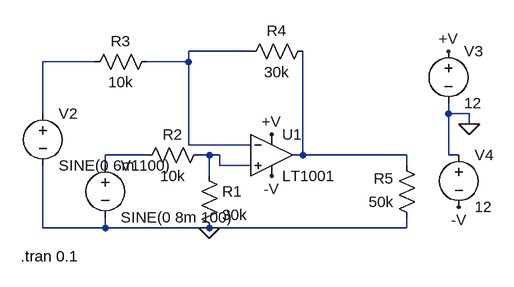
[diagram p0: schematic Draft21.asc]
Draft21.asc, the LTspice schematic file:
Version 4
SHEET 1 880 680
WIRE 192 16 96 16
WIRE -48 32 -128 32
WIRE 96 32 96 16
WIRE 96 32 32 32
WIRE -128 112 -128 32
WIRE 496 112 496 96
WIRE 528 112 496 112
WIRE 528 128 528 112
WIRE 96 160 96 32
WIRE 192 160 96 160
WIRE 32 176 -32 176
WIRE 128 176 112 176
WIRE 144 176 128 176
WIRE 272 176 272 16
WIRE 272 176 256 176
WIRE 432 176 272 176
WIRE 496 176 496 112
WIRE 512 176 496 176
WIRE -32 192 -32 176
WIRE 144 192 144 176
WIRE 192 192 144 192
WIRE 432 192 432 176
WIRE 128 208 128 176
WIRE -128 288 -128 192
WIRE -32 288 -32 272
WIRE -32 288 -128 288
WIRE 128 288 -32 288
WIRE 432 288 432 272
WIRE 432 288 128 288
FLAG 128 288 0
FLAG 496 16 +V
FLAG 224 144 +V
FLAG 224 208 -V
FLAG 512 256 -V
FLAG 528 128 0
SYMBOL Opamps\\LT1001 224 112 R0
SYMATTR InstName U1
SYMBOL res 112 192 R0
SYMATTR InstName R1
SYMATTR Value 30k
SYMBOL res 128 160 R90
WINDOW 0 0 56 VBottom 2
WINDOW 3 32 56 VTop 2
SYMATTR InstName R2
SYMATTR Value 10k
SYMBOL voltage -32 176 R0
WINDOW 123 0 0 Left 2
WINDOW 39 0 0 Left 2
SYMATTR InstName V1
SYMATTR Value SINE(0 8m 100)
SYMBOL voltage -128 96 R0
WINDOW 123 0 0 Left 2
WINDOW 39 0 0 Left 2
SYMATTR InstName V2
SYMATTR Value SINE(0 6m 100)
SYMBOL res 48 16 R90
WINDOW 0 0 56 VBottom 2
WINDOW 3 32 56 VTop 2
SYMATTR InstName R3
SYMATTR Value 10k
SYMBOL res 288 0 R90
WINDOW 0 0 56 VBottom 2
WINDOW 3 32 56 VTop 2
SYMATTR InstName R4
SYMATTR Value 30k
SYMBOL res 448 288 R180
WINDOW 0 36 76 Left 2
WINDOW 3 36 40 Left 2
SYMATTR InstName R5
SYMATTR Value 50k
SYMBOL voltage 496 0 R0
SYMATTR InstName V3
SYMATTR Value 12
SYMBOL voltage 512 160 R0
WINDOW 123 0 0 Left 2
WINDOW 39 0 0 Left 2
SYMATTR InstName V4
SYMATTR Value 12
TEXT -162 332 Left 2 !.tran 0.1

The netlist it stands for:
* Draft21.asc
XU1 N004 N001 +V -V N005 LT1001  ; pins In+ In- V+ V- OUT
R1 N004 0 30k
R2 N004 N003 10k
V1 N003 0 SINE(0 8m 100)
V2 N002 0 SINE(0 6m 100)
R3 N001 N002 10k
R4 N005 N001 30k
R5 0 N005 50k
V3 +V 0 12
V4 0 -V 12
.tran 0.1
.lib LTC.lib
.backanno
.end